# Altium project output_brd.PrjPcb
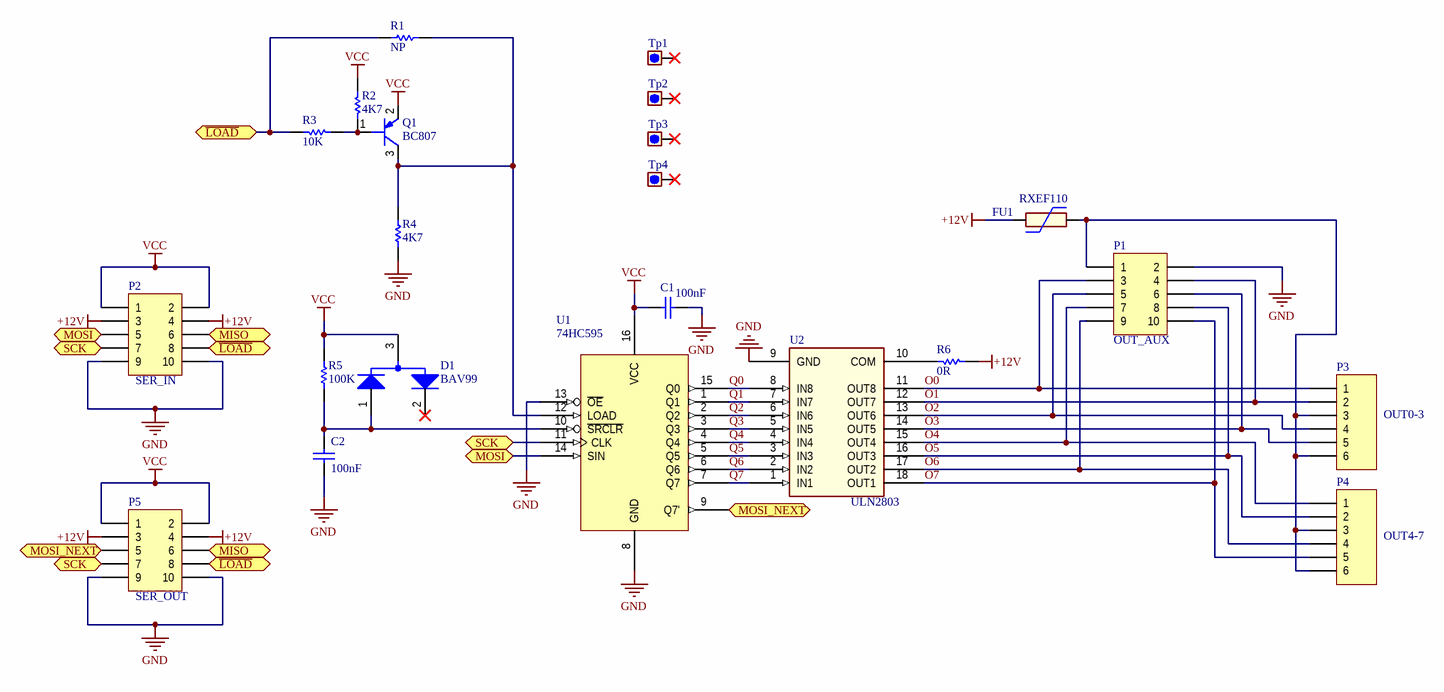
[diagram p0: output.SchDoc]
1 sheet, 22 parts. Net scope: flat (ports and power ports of the same name join across sheets).
Board file: output.PcbDoc

## Sheet output.SchDoc: SIPO output board
size A3; Author: Francesco Sacchi <batt@develer.com>; Organization: Develer s.r.l.; Address1: via Mugellese 1/A; Address2: 50019 Campi Bisenzio; Address3: Firenze; Address4: ITALY; DocumentNumber: 1; Revision: 0; SheetNumber: 1; SheetTotal: 6

### Parts
C1  100nF  [0603_[1608]]
C2  100nF  [0603_[1608]]
D1  BAV99  [SOT-23]
FU1  RXEF110  [RADIAL_5.08mm_polyswitch]
P1  OUT_AUX  [HEADER_2X5_2.54MM_THD_BOXED]
P2  SER_IN  [HEADER_2X5_2.54MM_THD_BOXED]
P3  OUT0-3  [TBLOCK_1X6_3.5MM_HOR_THD]
P4  OUT4-7  [TBLOCK_1X6_3.5MM_HOR_THD]
P5  SER_OUT  [HEADER_2X5_2.54MM_THD_BOXED]
Q1  BC807  [SOT-23]
R1  NP  [0603_[1608]]
R2  4K7  [0603_[1608]]
R3  10K  [0603_[1608]]
R4  4K7  [0603_[1608]]
R5  100K  [0603_[1608]]
R6  0R  [0603_[1608]]
Tp1  (no value)  [Hole_M3x6mm]  (no BOM)
Tp2  (no value)  [Hole_M3x6mm]  (no BOM)
Tp3  (no value)  [Hole_M3x6mm]  (no BOM)
Tp4  (no value)  [Hole_M3x6mm]  (no BOM)
U1  74HC595  [SOIC16]
U2  ULN2803  [SOIC18]

### Ports
MISO, MOSI, MOSI_NEXT, SCK, ~{LOAD}

### Nets
+12V: FU1.1 P2.3 P2.4 P5.3 P5.4 R6.1
GND: C1.1 C2.1 P1.2 P2.9 P2.10 P5.9 P5.10 R4.2 U1.8(GND) U1.13(~{OE}) U2.9(GND)
VCC: C1.2 D1.3 P2.1 P2.2 P5.1 P5.2 Q1.2(E) R2.2 R5.2 U1.16(VCC)
O0: P1.3 P3.1 U2.11(OUT8)
O1: P1.4 P3.2 U2.12(OUT7)
O2: P1.5 P3.4 U2.13(OUT6)
O3: P1.6 P3.5 U2.14(OUT5)
O4: P1.7 P4.1 U2.15(OUT4)
O5: P1.8 P4.2 U2.16(OUT3)
O6: P1.9 P4.4 U2.17(OUT2)
O7: P1.10 P4.5 U2.18(OUT1)
Q0: U1.15(Q0) U2.8(IN8)
Q1: U1.1(Q1) U2.7(IN7)
Q2: U1.2(Q2) U2.6(IN6)
Q3: U1.3(Q3) U2.5(IN5)
Q4: U1.4(Q4) U2.4(IN4)
Q5: U1.5(Q5) U2.3(IN3)
Q6: U1.6(Q6) U2.2(IN2)
Q7: U1.7(Q7) U2.1(IN1)
NetC2_2: C2.2 D1.1 R5.1 U1.10(~{SRCLR})
NetFU1_2: FU1.2 P1.1 P3.3 P3.6 P4.3 P4.6
NetP2_5: P2.5 U1.14(SIN) ; port MOSI
NetP2_6: P2.6 P5.6 ; port MISO
NetP2_7: P2.7 P5.7 U1.11(CLK) ; port SCK
NetP2_8: P2.8 P5.8 R1.2 R3.2 ; port ~{LOAD}
NetP5_5: P5.5 U1.9(Q7') ; port MOSI_NEXT
NetQ1_1: Q1.1(B) R2.1 R3.1
NetQ1_3: Q1.3(C) R1.1 R4.1 U1.12(LOAD)
NetR6_2: R6.2 U2.10(COM)

Not connected (* = marked no-connect by the designer): D1 2*; Tp1 1*; Tp2 1*; Tp3 1*; Tp4 1*

### Notes on the sheet
- Title:
- Author:
- License:
- BSD
- Rev:
- Size:
- A3
- File:
- Date:
- Time:
- Sheet
- of

### Library data of the parts
C1 C2 = Cap: Ceramic X5R 6.3V, 10V; Value: 10nF; Published: 8-Jun-2000; Revision: July-2002: Re-released for DXP Platform.; Publisher: Altium Limited
D1 = BAV99: SOT23
FU1 = FuseAutoReset: Fuse
P1 P2 P5 = Header 5X2: Header, 5-Pin, Dual row; LatestRevisionDate: 17-Jul-2002; LatestRevisionNote: Re-released for DXP Platform.; Publisher: Altium Limited
P3 P4 = Header 6: Header, 6-Pin; LatestRevisionDate: 17-Jul-2002; LatestRevisionNote: Re-released for DXP Platform.; Publisher: Altium Limited
Q1 = BC807: PNP transistor
R1-R6 = Res1: Resistor; Value: 1K; Published: 8-Jun-2000; Revision: July-2002: Re-released for DXP Platform.; Publisher: Altium Limited
Tp1-Tp4 = Test_point
U1 = 74HC595: 8-bit shift register with 3-state output registers
U2 = ULN2803: BJT Darlinton Array